# EAGLE design sensor de linha (EAGLE 6.4)
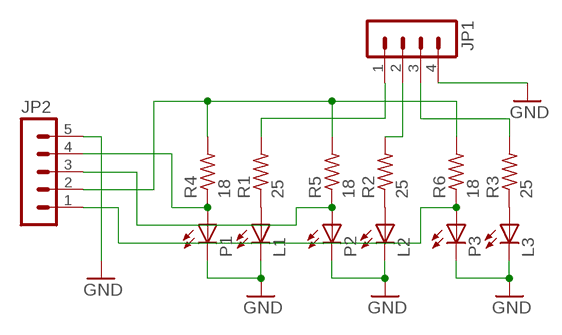
[diagram p0: schematic, sheet 1]

## Parts
JP1  MA04-1  [MA04-1]
JP2  MA05-1  [MA05-1]
L1  LED3MM  [LED3MM]
L2  LED3MM  [LED3MM]
L3  LED3MM  [LED3MM]
P1  LED3MM  [LED3MM]
P2  LED3MM  [LED3MM]
P3  LED3MM  [LED3MM]
R1  25  R-US_R0805  [R0805]
R2  25  R-US_R0805  [R0805]
R3  25  R-US_R0805  [R0805]
R4  18  R-US_R0805  [R0805]
R5  18  R-US_R0805  [R0805]
R6  18  R-US_R0805  [R0805]

## Nets
GND: JP1.4 JP2.5 L1.K(C) L2.K(C) L3.K(C) P1.K(C) P2.K(C) P3.K(C)
N$1: JP1.1 R1.2
N$2: L1.A R1.1
N$3: JP1.2 R2.2
N$4: JP1.3 R3.2
N$5: L2.A R2.1
N$6: L3.A R3.1
N$7: JP2.4 P1.A R4.1
N$9: JP2.1 P3.A R6.1
N$11: JP2.2 R4.2 R5.2 R6.2
N$13: JP2.3 P2.A R5.1

## Library data of the parts
JP1 = con-lstb:MA04-1: PIN HEADER; OC_FARNELL: unknown; OC_NEWARK: unknown
JP2 = con-lstb:MA05-1: PIN HEADER; OC_FARNELL: unknown; OC_NEWARK: unknown
L1-L3 P1-P3 = led:LED: LED OSRAM: - CHIPLED LG R971, LG N971, LY N971, LG Q971, LY Q971, LO R971, LY R971 LH N974, LH R974 LS Q976, LO Q976, LY Q976 LO Q996 - Hyper CHIPLED LW Q18S LB Q993, LB Q99A, LB R99A - SideLED LS A670, LO A670, LY A670, LG A670, LP A670 LB A673, LV A673, LT A673, LW A673 LH A674 LY A675 LS A676, LA A676, LO A676, LY A676, LW A676 LS A679, LY A679, LG A679 - Hyper Micro SIDELED® LS Y876, LA Y876, LO Y876, LY Y876 LT Y87S - SmartLED LW L88C, LW L88S LB L89C, LB L89S, LG L890 LS L89K, LO L89K, LY L89K LS L896, LA L896, LO L896, LY L896 - TOPLED LS T670, LO T670, LY T670, LG T670, LP T670 LSG T670, LSP T670, LSY T670, LOP T670, LYG T670 LG T671, LOG T671, LSG T671 LB T673, LV T673, LT T673, LW T673 LH T674 LS T676, LA T676, LO T676, LY T676, LB T676, LH T676, LSB T676, LW T676 LB T67C, LV T67C, LT T67C, LS T67K, LO T67K, LY T67K, LW E67C LS E67B, LA E67B, LO E67B, LY E67B, LB E67C, LV E67C, LT E67C LW T67C LS T679, LY T679, LG T679 LS T770, LO T770, LY T770, LG T770, LP T770 LB T773, LV T773, LT T773, LW T773 LH T774 LS E675, LA E675, LY E675, LS T675 LS T776, LA T776, LO T776, LY T776, LB T776 LHGB T686 LT T68C, LB T68C - Hyper Mini TOPLED® LB M676 - Mini TOPLED Santana® LG M470 LS M47K, LO M47K, LY M47K Source: http://www.osram.convergy.de LUXEON: - LUMILED® LXK2-PW12-R00, LXK2-PW12-S00, LXK2-PW14-U00, LXK2-PW14-V00 LXK2-PM12-R00, LXK2-PM12-S00, LXK2-PM14-U00 LXK2-PE12-Q00, LXK2-PE12-R00, LXK2-PE12-S00, LXK2-PE14-T00, LXK2-PE14-U00 LXK2-PB12-K00, LXK2-PB12-L00, LXK2-PB12-M00, LXK2-PB14-N00, LXK2-PB14-P00, LXK2-PB14-Q00 LXK2-PR12-L00, LXK2-PR12-M00, LXK2-PR14-Q00, LXK2-PR14-R00 LXK2-PD12-Q00, LXK2-PD12-R00, LXK2-PD12-S00 LXK2-PH12-R00, LXK2-PH12-S00 LXK2-PL12-P00, LXK2-PL12-Q00, LXK2-PL12-R00 Source: www.luxeon.com KINGBRIGHT: KA-3528ASYC Source: www.kingbright.com
R1-R6 = rcl:R-US_: RESISTOR, American symbol

## Board
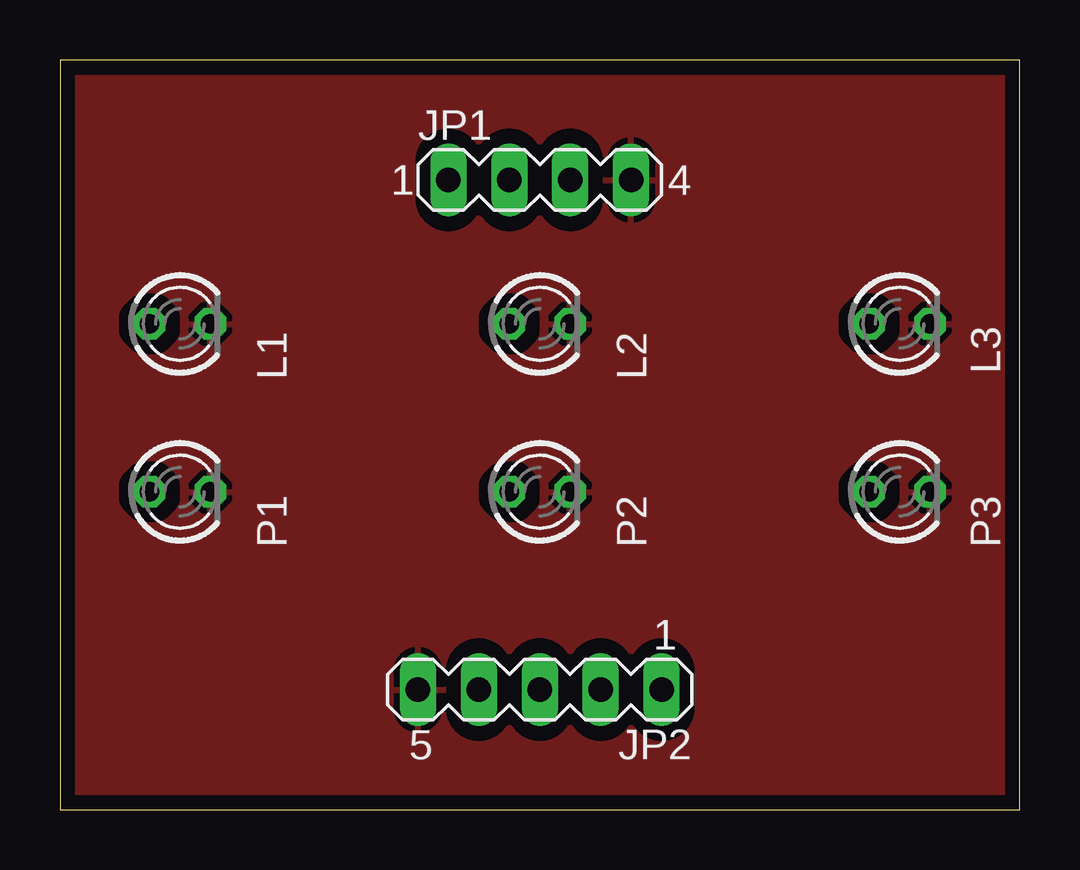
[diagram p1: board, top side]
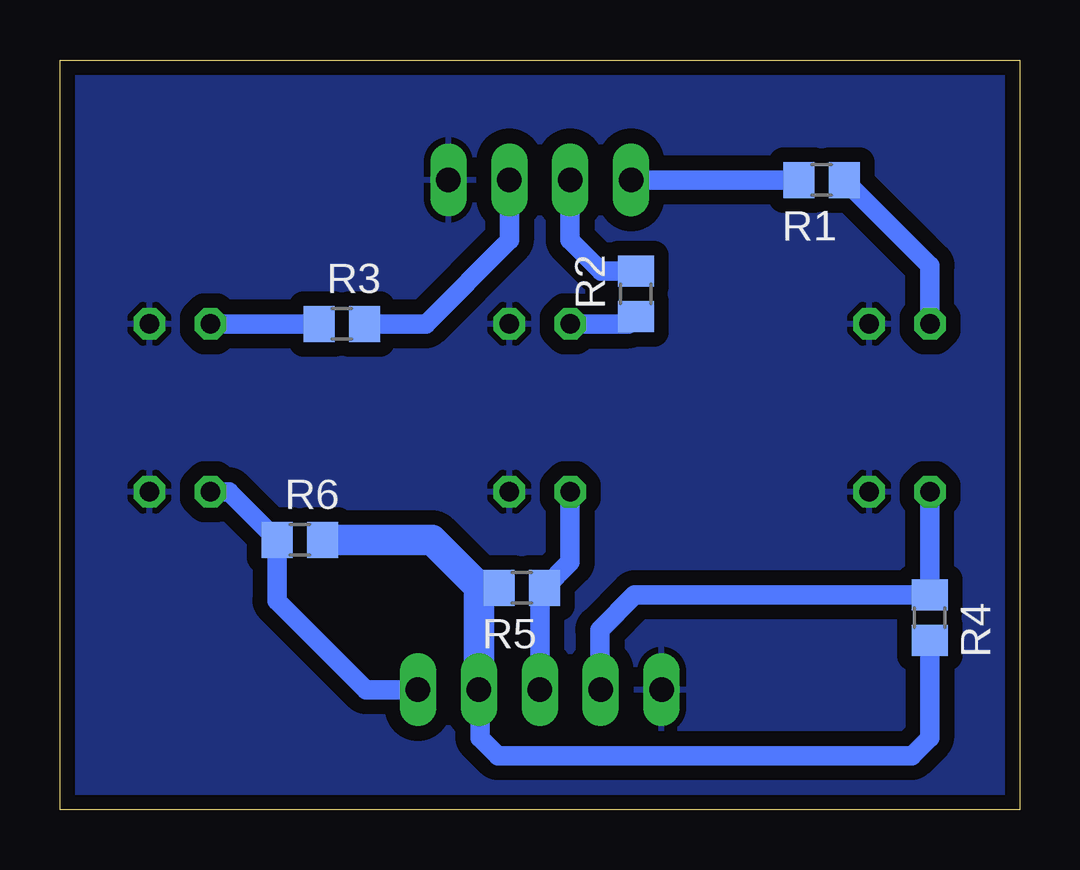
[diagram p2: board, bottom side, seen from below]

Size 40 x 31.25 mm. Coordinates in mm from the lower left corner, seen from the top.
Outline: 0,0 40,0 40,31.25 0,31.25 0,0
Copper layers (1*16): Top 0.035mm / dielectric 1.5mm / Bottom 0.035mm
Design rules "ITEADstudio_DRC": minimum track width 6mil, minimum drill 12mil, track to track 6mil, track to pad 6mil, pad to pad 6mil, via to via 6mil, smd to smd 0mil, copper to edge 10mil, drill to drill 10mil, minimum pad ring 10mil, minimum via ring 6mil, stop-mask expansion 2mil, vias tented up to drill 100mil, thermal gap 10mil

### Footprints (pad centres in the part's own frame; a part is rotated, then mirrored left to right if it is on the bottom)
MA04-1 = drill 1.016 long: 1 -3.81,0; 2 -1.27,0; 3 1.27,0; 4 3.81,0
MA05-1 = drill 1.016 long: 1 -5.08,0; 2 -2.54,0; 3 0,0; 4 2.54,0; 5 5.08,0
LED3MM = drill 0.813 octagon: A -1.27,0; K 1.27,0
R0805 = smd 1.3 x 1.5: 1 -0.95,0; 2 0.95,0

### Placement (x,y rotation side)
JP1  20,26.25 0 top
JP2  20,5 180 top
L1  5,20.25 0 top
L2  20,20.25 0 top
L3  35,20.25 0 top
P1  5,13.25 0 top
P2  20,13.25 0 top
P3  35,13.25 0 top
R1  8.25,26.25 180 bottom
R2  16,21.5 90 bottom
R3  28.25,20.25 0 bottom
R4  3.75,8 270 bottom
R5  20.75,9.25 180 bottom
R6  30,11.25 0 bottom

### Tracks (layer width: path | path; a pad name or v marks a point on that pad's centre or on a via)
GND
  pour Bottom (isolate 0.61): 0,0 40,0 40,31.25 0,31.25
  pour Top (isolate 0.61): 0,0 40,0 40,31.25 0,31.25
N$1
  Bottom 0.813: R1.2 JP1.1
N$2
  Bottom 0.813: L1.A 3.73,22.68 R1.1
N$3
  Bottom 0.813: JP1.2 18.73,23.73 17.45,22.45 R2.2
N$4
  Bottom 0.813: JP1.3 21.27,23.73 24.75,20.25 R3.2
N$5
  Bottom 0.813: L2.A 16.3,20.25 R2.1
N$6
  Bottom 0.813: R3.1 L3.A
N$7
  Bottom 0.813: JP2.4 17.5,5.04 17.5,7.5 16.05,8.95 R4.1 3.75,13.23 P1.A
N$9
  Bottom 0.813: JP2.1 27.25,5 30.95,8.7 R6.1 32.95,13.25 P3.A
N$11
  Bottom 0.813: R4.2 3.75,3 4.5,2.25 21.75,2.25 22.5,3 22.5,4.96 JP2.2
  Bottom 1.27: JP2.2 22.54,9.21 22.5,9.25 | R6.2 24.5,11.25 22.5,9.25 | 22.5,9.25 R5.2
N$13
  Bottom 0.813: P2.A 18.73,10.32 R5.1 20,9.05 JP2.3